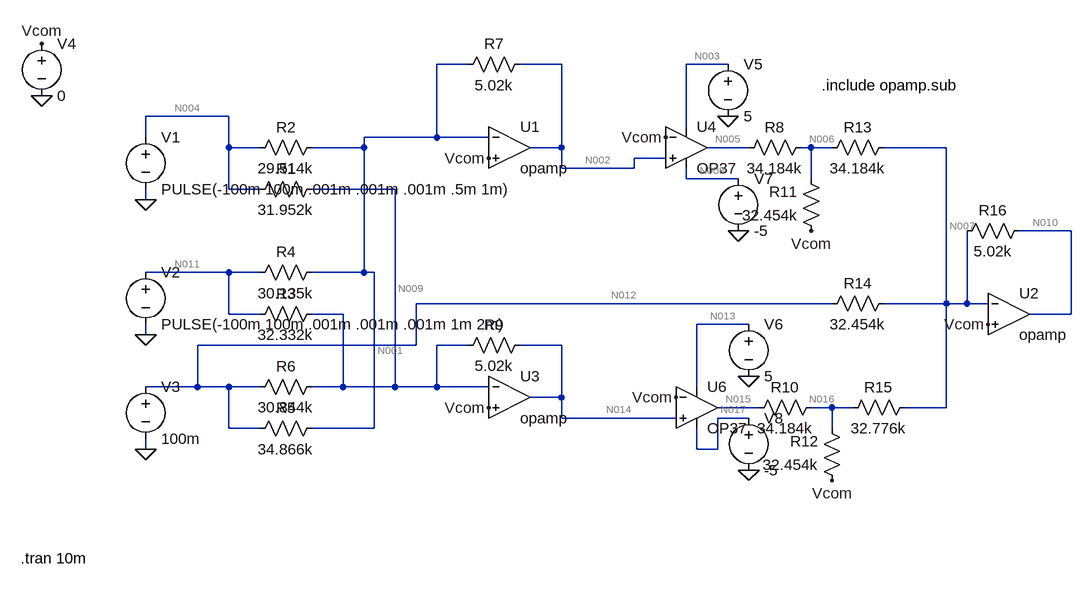
[diagram p0: schematic madaline_trial.asc]
madaline_trial.asc, the LTspice schematic file:
Version 4
SHEET 1 1252 732
WIRE 320 -48 272 -48
WIRE 464 -48 400 -48
WIRE 720 -48 656 -48
WIRE -48 32 -176 32
WIRE 656 48 656 -48
WIRE -176 64 -176 32
WIRE 272 64 272 -48
WIRE 272 64 160 64
WIRE 352 64 272 64
WIRE -48 80 -48 32
WIRE 0 80 -48 80
WIRE 160 80 160 64
WIRE 160 80 80 80
WIRE 464 80 464 -48
WIRE 464 80 416 80
WIRE 752 80 688 80
WIRE 848 80 832 80
WIRE 880 80 848 80
WIRE 1056 80 960 80
WIRE 624 96 576 96
WIRE 464 112 464 80
WIRE 576 112 576 96
WIRE 576 112 464 112
WIRE 656 128 656 112
WIRE 736 128 656 128
WIRE 848 128 848 80
WIRE -48 144 -48 80
WIRE 0 144 -48 144
WIRE 208 144 80 144
WIRE -176 160 -176 144
WIRE 1248 208 1168 208
WIRE -48 272 -176 272
WIRE 0 272 -48 272
WIRE 160 272 160 80
WIRE 160 272 80 272
WIRE 176 272 160 272
WIRE 880 320 240 320
WIRE 1056 320 1056 80
WIRE 1056 320 960 320
WIRE 1088 320 1088 208
WIRE 1088 320 1056 320
WIRE 1120 320 1088 320
WIRE -48 336 -48 272
WIRE 0 336 -48 336
WIRE 128 336 80 336
WIRE 1248 336 1248 208
WIRE 1248 336 1184 336
WIRE 752 352 672 352
WIRE -176 368 -176 352
WIRE 240 384 240 320
WIRE 240 384 -96 384
WIRE 320 384 272 384
WIRE 464 384 400 384
WIRE -96 448 -96 384
WIRE -96 448 -176 448
WIRE -48 448 -96 448
WIRE 0 448 -48 448
WIRE 128 448 128 336
WIRE 128 448 80 448
WIRE 208 448 208 144
WIRE 208 448 128 448
WIRE 272 448 272 384
WIRE 272 448 208 448
WIRE 352 448 272 448
WIRE 672 448 672 352
WIRE 464 464 464 384
WIRE 464 464 416 464
WIRE 768 480 704 480
WIRE 880 480 848 480
WIRE 912 480 880 480
WIRE 1056 480 1056 320
WIRE 1056 480 992 480
WIRE 464 496 464 464
WIRE 640 496 464 496
WIRE 752 496 704 496
WIRE -48 512 -48 448
WIRE 0 512 -48 512
WIRE 176 512 176 272
WIRE 176 512 80 512
WIRE 880 512 880 480
WIRE -176 544 -176 528
WIRE 672 544 672 512
WIRE 704 544 704 496
WIRE 704 544 672 544
FLAG -176 160 0
FLAG -176 368 0
FLAG -176 544 0
FLAG 352 96 Vcom
FLAG 352 480 Vcom
FLAG 848 208 Vcom
FLAG 880 592 Vcom
FLAG -336 -80 Vcom
FLAG -336 0 0
FLAG 1120 352 Vcom
FLAG 720 32 0
FLAG 736 208 0
FLAG 752 432 0
FLAG 752 576 0
FLAG 624 64 Vcom
FLAG 640 464 Vcom
SYMBOL res 96 128 R90
WINDOW 0 0 56 VBottom 2
WINDOW 3 32 56 VTop 2
SYMATTR InstName R1
SYMATTR Value 31.952k
SYMBOL res 96 64 R90
WINDOW 0 0 56 VBottom 2
WINDOW 3 32 56 VTop 2
SYMATTR InstName R2
SYMATTR Value 29.514k
SYMBOL res 96 320 R90
WINDOW 0 0 56 VBottom 2
WINDOW 3 32 56 VTop 2
SYMATTR InstName R3
SYMATTR Value 32.332k
SYMBOL res 96 256 R90
WINDOW 0 0 56 VBottom 2
WINDOW 3 32 56 VTop 2
SYMATTR InstName R4
SYMATTR Value 30.135k
SYMBOL res 96 496 R90
WINDOW 0 0 56 VBottom 2
WINDOW 3 32 56 VTop 2
SYMATTR InstName R5
SYMATTR Value 34.866k
SYMBOL res 96 432 R90
WINDOW 0 0 56 VBottom 2
WINDOW 3 32 56 VTop 2
SYMATTR InstName R6
SYMATTR Value 30.844k
SYMBOL Opamps\\opamp 384 16 R0
SYMATTR InstName U1
SYMBOL Opamps\\opamp 384 400 R0
SYMATTR InstName U3
SYMBOL voltage -176 48 R0
WINDOW 123 0 0 Left 2
WINDOW 39 0 0 Left 2
SYMATTR InstName V1
SYMATTR Value PULSE(-100m 100m .001m .001m .001m .5m 1m)
SYMBOL voltage -176 256 R0
WINDOW 123 0 0 Left 2
WINDOW 39 0 0 Left 2
SYMATTR InstName V2
SYMATTR Value PULSE(-100m 100m .001m .001m .001m 1m 2m)
SYMBOL voltage -176 432 R0
WINDOW 123 0 0 Left 2
WINDOW 39 0 0 Left 2
SYMATTR InstName V3
SYMATTR Value 100m
SYMBOL res 416 -64 R90
WINDOW 0 0 56 VBottom 2
WINDOW 3 32 56 VTop 2
SYMATTR InstName R7
SYMATTR Value 5.02k
SYMBOL res 416 368 R90
WINDOW 0 0 56 VBottom 2
WINDOW 3 32 56 VTop 2
SYMATTR InstName R9
SYMATTR Value 5.02k
SYMBOL Opamps\\OP37 656 16 R0
SYMATTR InstName U4
SYMBOL Opamps\\OP37 672 416 R0
SYMATTR InstName U6
SYMBOL res 848 64 R90
WINDOW 0 0 56 VBottom 2
WINDOW 3 32 56 VTop 2
SYMATTR InstName R8
SYMATTR Value 34.184k
SYMBOL res 864 464 R90
WINDOW 0 0 56 VBottom 2
WINDOW 3 32 56 VTop 2
SYMATTR InstName R10
SYMATTR Value 34.184k
SYMBOL res 864 224 R180
WINDOW 0 36 76 Left 2
WINDOW 3 36 40 Left 2
SYMATTR InstName R11
SYMATTR Value 32.454k
SYMBOL res 896 608 R180
WINDOW 0 36 76 Left 2
WINDOW 3 36 40 Left 2
SYMATTR InstName R12
SYMATTR Value 32.454k
SYMBOL res 976 64 R90
WINDOW 0 0 56 VBottom 2
WINDOW 3 32 56 VTop 2
SYMATTR InstName R13
SYMATTR Value 34.184k
SYMBOL res 976 304 R90
WINDOW 0 0 56 VBottom 2
WINDOW 3 32 56 VTop 2
SYMATTR InstName R14
SYMATTR Value 32.454k
SYMBOL res 1008 464 R90
WINDOW 0 0 56 VBottom 2
WINDOW 3 32 56 VTop 2
SYMATTR InstName R15
SYMATTR Value 32.776k
SYMBOL Opamps\\opamp 1152 272 R0
SYMATTR InstName U2
SYMBOL voltage -336 -96 R0
WINDOW 123 0 0 Left 2
WINDOW 39 0 0 Left 2
SYMATTR InstName V4
SYMATTR Value 0
SYMBOL res 1184 192 R90
WINDOW 0 0 56 VBottom 2
WINDOW 3 32 56 VTop 2
SYMATTR InstName R16
SYMATTR Value 5.02k
SYMBOL voltage 720 -64 R0
WINDOW 123 0 0 Left 2
WINDOW 39 0 0 Left 2
SYMATTR InstName V5
SYMATTR Value 5
SYMBOL voltage 752 336 R0
WINDOW 123 0 0 Left 2
WINDOW 39 0 0 Left 2
SYMATTR InstName V6
SYMATTR Value 5
SYMBOL voltage 736 112 R0
WINDOW 123 0 0 Left 2
WINDOW 39 0 0 Left 2
SYMATTR InstName V7
SYMATTR Value -5
SYMBOL voltage 752 480 R0
WINDOW 123 0 0 Left 2
WINDOW 39 0 0 Left 2
SYMATTR InstName V8
SYMATTR Value -5
TEXT -368 712 Left 2 !.tran 10m
TEXT 864 -16 Left 2 !.include opamp.sub

The netlist it stands for:
* madaline_trial.asc
R1 N009 N004 31.952k
R2 N001 N004 29.514k
R3 N009 N011 32.332k
R4 N001 N011 30.135k
R5 N001 N012 34.866k
R6 N009 N012 30.844k
XU1 N001 Vcom N002 opamp Aol=100K GBW=10Meg  ; pins invin noninvin out
XU3 N009 Vcom N014 opamp Aol=100K GBW=10Meg  ; pins invin noninvin out
V1 N004 0 PULSE(-100m 100m .001m .001m .001m .5m 1m)
V2 N011 0 PULSE(-100m 100m .001m .001m .001m 1m 2m)
V3 N012 0 100m
R7 N002 N001 5.02k
R9 N014 N009 5.02k
XU4 N002 Vcom N003 N008 N005 LT1037  ; OP37, pins In+ In- V+ V- OUT
XU6 N014 Vcom N013 N017 N015 LT1037  ; OP37, pins In+ In- V+ V- OUT
R8 N006 N005 34.184k
R10 N016 N015 34.184k
R11 Vcom N006 32.454k
R12 Vcom N016 32.454k
R13 N007 N006 34.184k
R14 N007 N012 32.454k
R15 N007 N016 32.776k
XU2 N007 Vcom N010 opamp Aol=100K GBW=10Meg  ; pins invin noninvin out
V4 Vcom 0 0
R16 N010 N007 5.02k
V5 N003 0 5
V6 N013 0 5
V7 N008 0 -5
V8 N017 0 -5
.tran 10m
.include opamp.sub
.lib LTC.lib
.backanno
.end

* Results of the author's LTspice run, read from the files saved beside the schematic
* Operating Point, zero values left out:
*   V(n009) = -149.6 nV
*   V(n004) = -100 mV
*   V(n001) = -192.7 nV
*   V(n011) = -100 mV
*   V(n012) = 100 mV
*   V(n002) = 19.27 mV
*   V(n014) = 14.96 mV
*   V(n003) = 5 V
*   V(n005) = 3.782 V
*   V(n008) = -5 V
*   V(n013) = 5 V
*   V(n015) = 3.766 V
*   V(n017) = -5 V
*   V(n006) = 1.239 V
*   V(n016) = 1.216 V
*   V(n007) = 3.837 µV
*   V(n010) = -383.7 mV
*   I(R16) = -76.43 µA
*   I(R15) = -37.11 µA
*   I(R14) = -3.081 µA
*   I(R13) = -36.23 µA
*   I(R12) = -37.48 µA
*   I(R11) = -38.16 µA
*   I(R10) = -74.6 µA
*   I(R8) = -74.39 µA
*   I(R9) = 2.98 µA
*   I(R7) = 3.838 µA
*   I(R6) = -3.242 µA
*   I(R5) = -2.868 µA
*   I(R4) = 3.318 µA
*   I(R3) = 3.093 µA
*   I(R2) = 3.388 µA
*   I(R1) = 3.13 µA
*   I(V8) = 2.629 mA
*   I(V7) = 2.629 mA
*   I(V6) = -2.696 mA
*   I(V5) = -2.694 mA
*   I(V4) = 75.65 µA
*   I(V3) = -9.191 µA
*   I(V2) = 6.411 µA
*   I(V1) = 6.518 µA
*   Ix(u1:3) = -3.838 µA
*   Ix(u3:3) = -2.98 µA
*   Ix(u4:1) = 2.047 pA
*   Ix(u4:3) = 2.694 mA
*   Ix(u4:4) = -2.629 mA
*   Ix(u4:5) = -74.39 µA
*   Ix(u6:1) = 1.59 pA
*   Ix(u6:3) = 2.696 mA
*   Ix(u6:4) = -2.629 mA
*   Ix(u6:5) = -74.6 µA
*   Ix(u2:3) = 76.43 µA
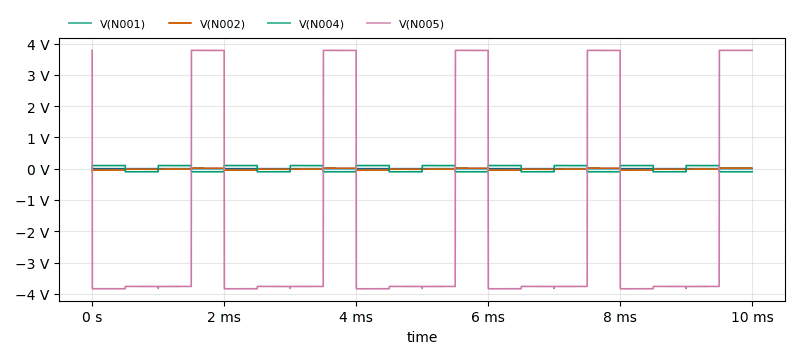
[diagram p1: Transient Analysis of madaline_trial.asc, plotted from the saved traces]
* Transient Analysis, 1 run:
*   V(N001): min -549.3 µV, max 1.072 mV, average 146.9 nV, rms 33.34 µV, last -192.7 nV
*   V(N002): min -48.07 mV, max 19.27 mV, average -14.45 mV, rms 27.85 mV, last 19.27 mV
*   V(N004): min -100 mV, max 100 mV, average 200 µV, rms 99.94 mV, last -100 mV
*   V(N005): min -3.839 V, max 3.782 V, average -1.902 V, rms 3.786 V, last 3.782 V